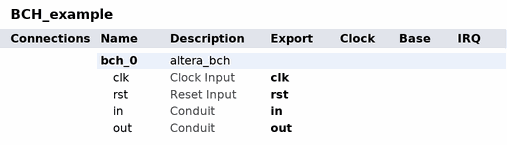
[diagram p0: system contents]
# Platform Designer (Qsys) system BCH_example, Cyclone V 5CSEMA5F31C6
# Parameters at their usual value, and those the tool derives, are not listed.
package require -exact qsys 16.1
create_system BCH_example
set_project_property DEVICE_FAMILY {Cyclone V}
set_project_property DEVICE 5CSEMA5F31C6

add_instance bch_0 altera_bch 16.1
set_instance_property bch_0 AUTO_EXPORT true
set_instance_parameter_value bch_0 BCH Encoder
set_instance_parameter_value bch_0 DATA_WIDTH 1
set_instance_parameter_value bch_0 M_BITS 8
set_instance_parameter_value bch_0 N_BITS 79
set_instance_parameter_value bch_0 T_BITS 5
set_instance_parameter_value bch_0 design_env NATIVE
set_instance_parameter_value bch_0 selected_device_family {Cyclone V}

# exported interfaces
add_interface clk clock sink
set_interface_property clk EXPORT_OF bch_0.clk
add_interface in conduit end
set_interface_property in EXPORT_OF bch_0.in
add_interface out conduit end
set_interface_property out EXPORT_OF bch_0.out
add_interface rst reset sink
set_interface_property rst EXPORT_OF bch_0.rst

set_interconnect_requirement {$system} qsys_mm.clockCrossingAdapter HANDSHAKE
set_interconnect_requirement {$system} qsys_mm.enableEccProtection FALSE
set_interconnect_requirement {$system} qsys_mm.insertDefaultSlave FALSE
set_interconnect_requirement {$system} qsys_mm.maxAdditionalLatency 1

save_system BCH_example.qsys
